# EAGLE design TactileSw (EAGLE 6.6.0)
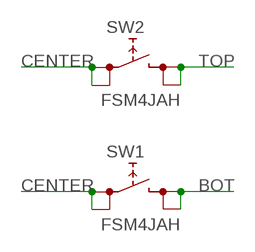
[diagram p0: schematic, sheet 1]

## Parts
SW1  FSM4JAH  [FSM4JAH]
SW2  FSM4JAH  [FSM4JAH]

## Nets
BOT: SW1.3 SW1.4
CENTER: SW1.1 SW1.2 SW2.1 SW2.2
TOP: SW2.3 SW2.4

## Library data of the parts
SW1 SW2 = dec-con:FSM4JAH: FSM4JAH 6mm SMD tactile switch.

## Board
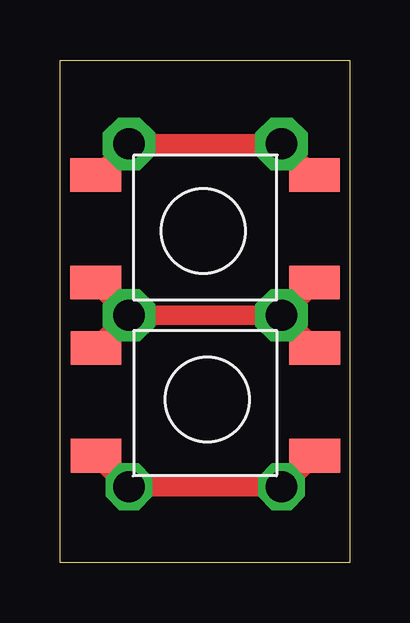
[diagram p1: board, top side]

Size 12.06 x 20.95 mm. Coordinates in mm from the lower left corner, seen from the top.
Outline: 0,0 0,20.95 12.06,20.95 12.06,0 0,0
Copper layers (1+16): Top 0.035mm / dielectric 1.5mm / Bottom 0.035mm
Design rules "16mils": minimum track width 16mil, minimum drill 32mil, track to track 15mil, track to pad 10mil, pad to pad 10mil, via to via 10mil, smd to smd 10mil, copper to edge 13mil, drill to drill 10mil, minimum pad ring 10mil, minimum via ring 8mil, stop-mask expansion 0mil, vias tented up to drill 0mil, thermal gap 10mil

### Footprints (pad centres in the part's own frame; a part is rotated, then mirrored left to right if it is on the bottom)
FSM4JAH = smd 1.397 x 2.108: 1 4.496,9.119; 2 4.496,0; 3 0,9.119; 4 0,0

### Placement (x,y rotation side)
SW1  10.62,4.46 90 top
SW2  1.49,16.17 270 top

### Tracks (layer width: path | path; a pad name or v marks a point on that pad's centre or on a via)
BOT  (via drill 1.3)
  Top 0.813: SW1.4 v9.23,3.17 v2.88,3.17 SW1.3
CENTER  (via drill 1.3 pad 2.18)
  Top 0.813: SW2.1 10.59,11.68 v9.23,10.32 | SW2.2 1.52,11.68 v2.88,10.32 | v2.88,10.32 v9.23,10.32 | SW1.1 v2.88,10.32 | SW1.2 v9.23,10.32
TOP  (via drill 1.3 pad 2.18)
  Top 0.813: SW2.4 1.59,16.17 v2.88,17.46 v9.23,17.46 10.52,16.17 SW2.3